# EAGLE schematic TSOC_CYBLE_R0_1 (EAGLE 6.6.0)
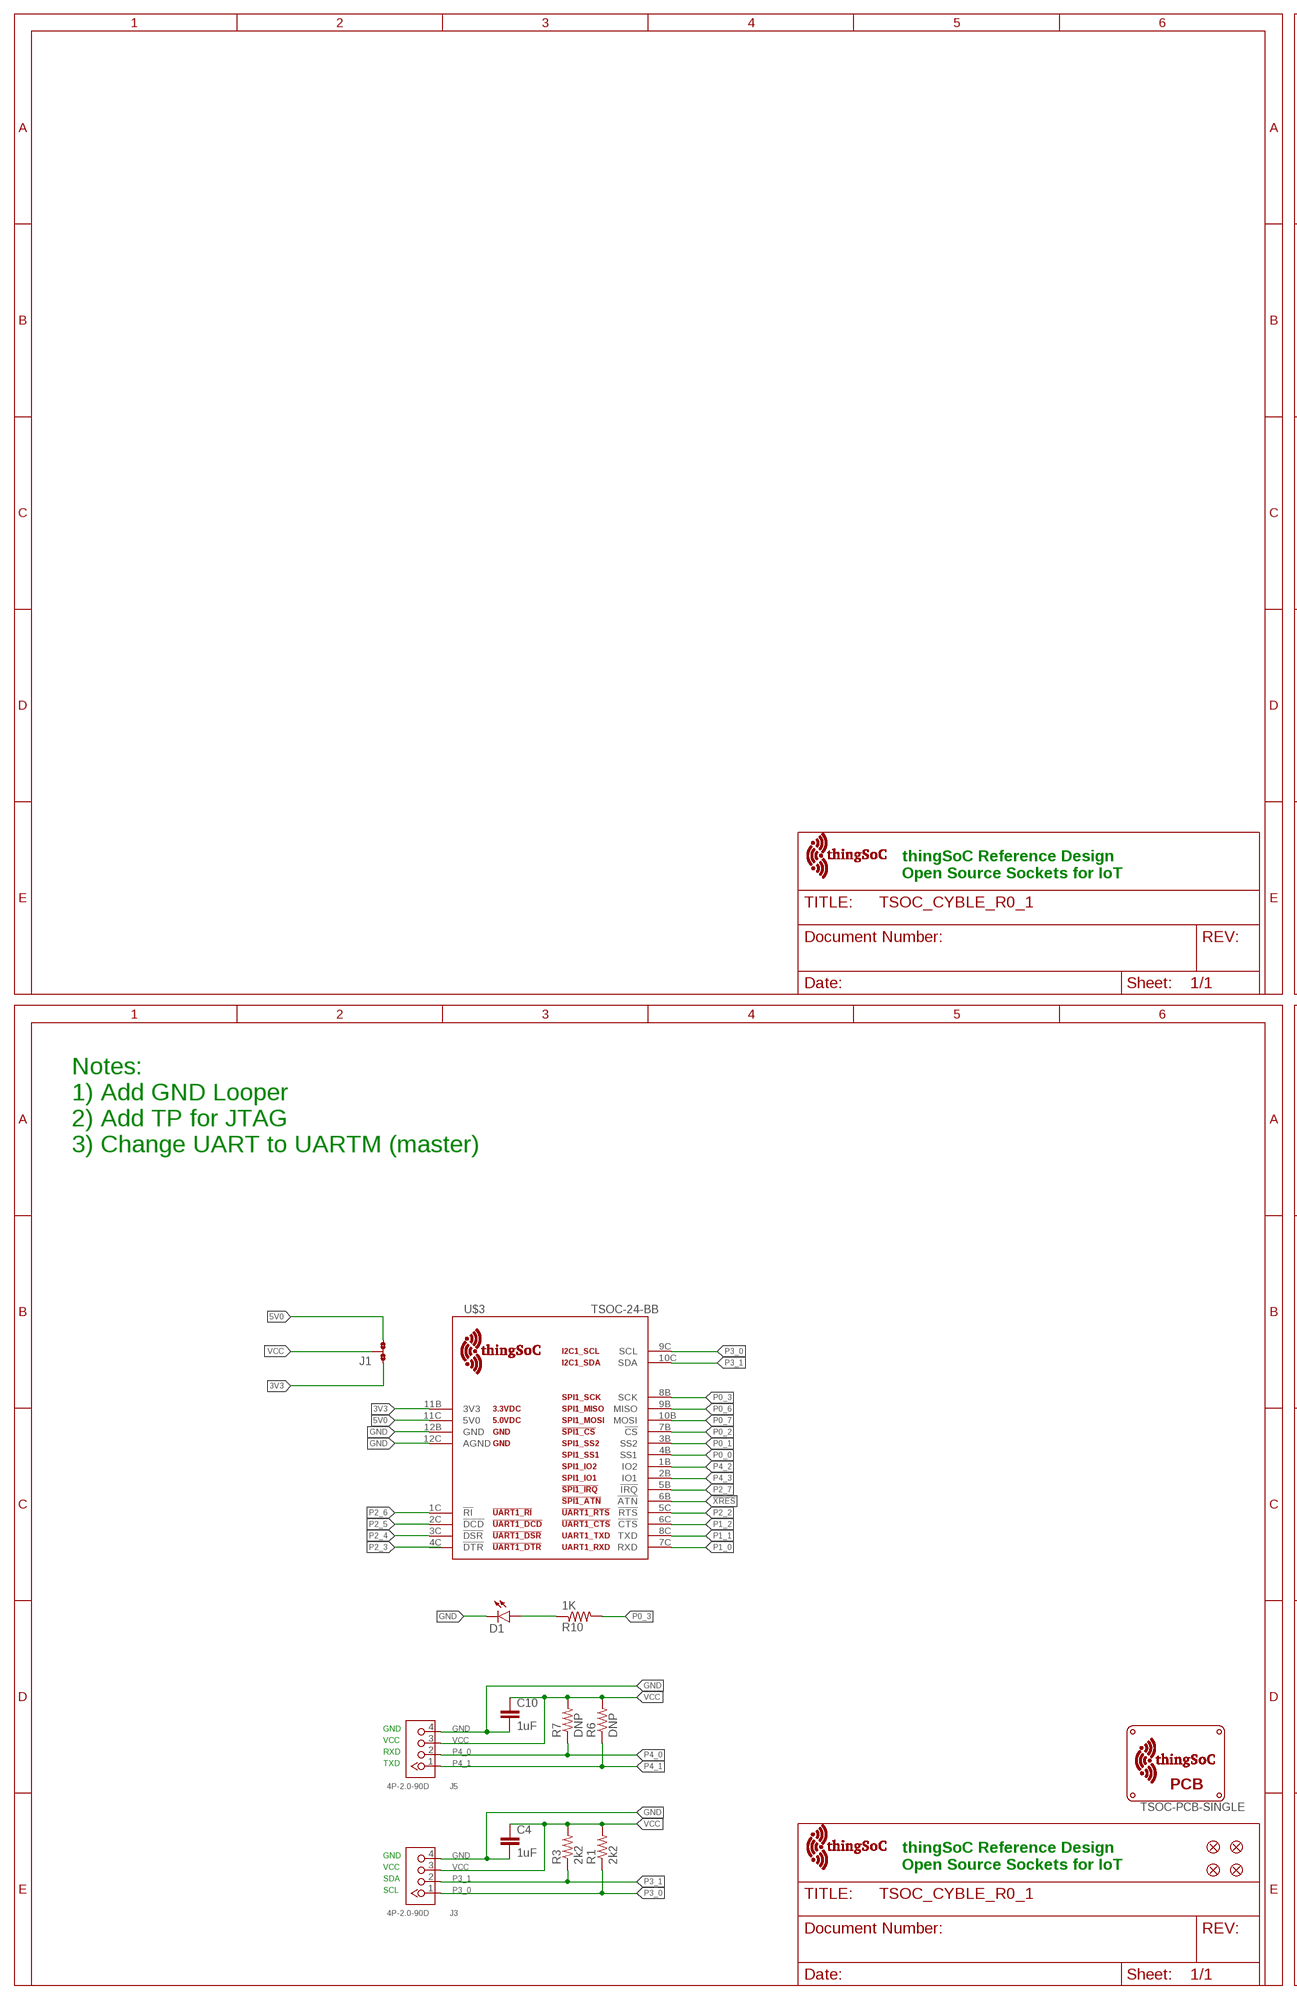
[diagram p0: schematic, sheet 1, part 1 of 2]
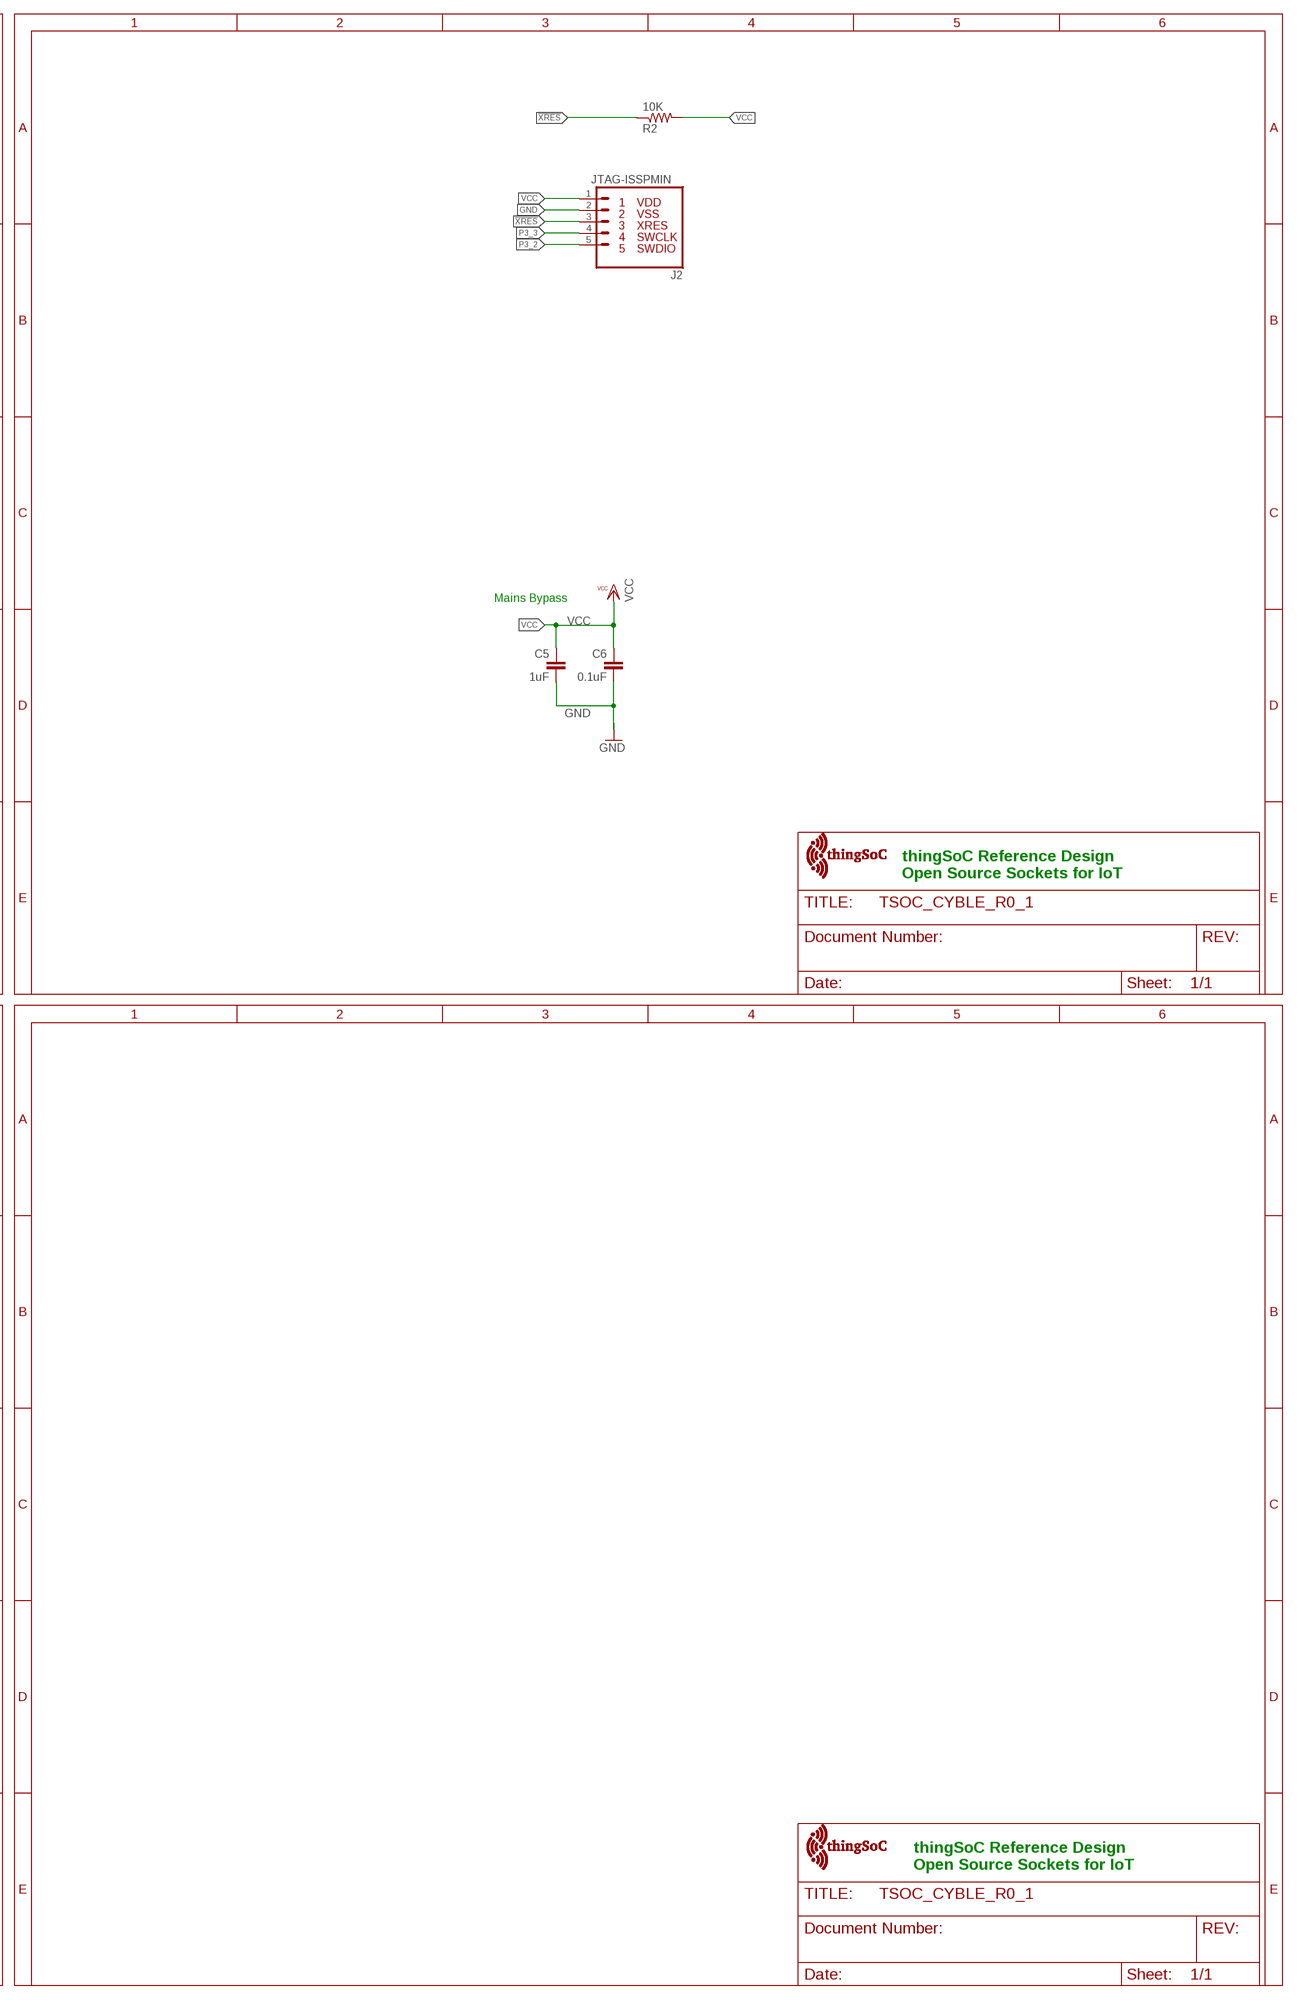
[diagram p1: schematic, sheet 1, part 2 of 2]

## Parts
C4  1uF  CAP0603-CAP  [0603-CAP]
C5  1uF  CAP0603-CAP  [0603-CAP]
C6  0.1uF  CAP0603-CAP  [0603-CAP]
C10  1uF  CAP0603-CAP  [0603-CAP]
D1  LED0603  [LED-0603]
FID1  FIDUCIALUFIDUCIAL  [MICRO-FIDUCIAL]
FID2  FIDUCIALUFIDUCIAL  [MICRO-FIDUCIAL]
FID3  FIDUCIALUFIDUCIAL  [MICRO-FIDUCIAL]
FID4  FIDUCIALUFIDUCIAL  [MICRO-FIDUCIAL]
J1  JMP-3-NO-PTH  [JMP-3-NO-PTH-2.54]
J2  JTAG-ISSPMIN  [PSOC_JTAG_MINSILK]
J3  4P-2.0-90D  GROVE-CONNECTOR-DIP-90D(4P-2.0)  [HW4-2.0-90D]
J5  4P-2.0-90D  GROVE-CONNECTOR-DIP-90D(4P-2.0)  [HW4-2.0-90D]
R1  2k2  RESISTOR0603-RES  [0603-RES]
R2  10K  RESISTOR_SFE0603-RES  [0603-RES]
R3  2k2  RESISTOR0603-RES  [0603-RES]
R6  DNP  RESISTOR0603-RES  [0603-RES]
R7  DNP  RESISTOR0603-RES  [0603-RES]
R10  1K  RESISTOR_SFE0603-RES  [0603-RES]
U$1  TSOC-LOGO-MED  [TSOC-LOGO-MED]
U$2  TSOC-PCB-SINGLE  [TSOC-BB-BRD-DIM]
U$3  TSOC-24-BB  [TSOC-BB-S24]
U$4  TSOC-LOGO-MED  [TSOC-LOGO-MED]
U$100  TSOC-LOGO-SMALL  [TSOC-LOGO-SML]
U$101  TSOC-LOGO-LRG  [TSOC-LOGO-LRG]

## Nets
3V3: J1.1 U$3.11B(3V3)
5V0: J1.3 U$3.11C(5V0)
!XRES: J2.3 R2.1 U$3.6B(!ATN)
GND: C4.2 C5.2 C6.2 C10.2 D1.C J2.2 J3.4 J5.4 U$3.12B(GND) U$3.12C(AGND)
N$17: D1.A R10.1
P0_0: U$3.4B(SS1)
P0_1: U$3.3B(SS2)
P0_2: U$3.7B(!CS)
P0_3: R10.2 U$3.8B(SCK)
P0_6: U$3.9B(MISO)
P0_7: U$3.10B(MOSI)
P1_0: U$3.7C(RXD)
P1_1: U$3.8C(TXD)
P1_2: U$3.6C(!CTS)
P2_2: U$3.5C(!RTS)
P2_3: U$3.4C(!DTR)
P2_4: U$3.3C(!DSR)
P2_5: U$3.2C(!DCD)
P2_6: U$3.1C(!RI)
P2_7: U$3.5B(!IRQ)
P3_0: J3.1 R1.1 U$3.9C(SCL)
P3_1: J3.2 R3.1 U$3.10C(SDA)
P3_2: J2.5
P3_3: J2.4
P4_0: J5.2 R7.1
P4_1: J5.1 R6.1
P4_2: U$3.1B(IO2)
P4_3: U$3.2B(IO1)
VCC: C4.1 C5.1 C6.1 C10.1 J1.2 J2.1 J3.3 J5.3 R1.2 R2.2 R3.2 R6.2 R7.2

## Notes on the sheet
- Mains Bypass
- thingSoC Reference Design
  Open Source Sockets for IoT
- thingSoC Reference Design
  Open Source Sockets for IoT
- Notes:
  1) Add GND Looper
  2) Add TP for JTAG
  3) Change UART to UARTM (master)
- GND
- VCC
- RXD
- TXD
- GND
- VCC
- thingSoC Reference Design
  Open Source Sockets for IoT
- thingSoC Reference Design
  Open Source Sockets for IoT
- SDA
- SCL

## Library data of the parts
C4 C10 = SparkFun-Passives:CAP: Capacitor Standard 0603 ceramic capacitor, and 0.1" leaded capacitor.
C5 C6 = PatternAgents-Misc:CAP: Capacitor Standard 0603 ceramic capacitor, and 0.1" leaded capacitor.
D1 = TSOC-ESP8266-BASE:LED: LEDs Standard schematic elements and footprints for 5mm, 3mm, 1206, and 0603 sized LEDs. 5mm - Spark Fun Electronics SKU : COM-00529 (and others)
FID1-FID4 = TSOC-ESP8266-BASE:FIDUCIAL: Fiducial Alignment Points Various fiducial points for machine vision alignment.
J1 = PatternAgents-ProtoPads:JMP-3-NO: Three Terminal Jumper - Normally Open All Pads Open (unconnected) PatternAgents ProtoPads Library Schematic and PCB layout libraries for design patterns by PatternAgents. For the CADSoft Eagle CAD program : http://www.cadsoftusa.com/download-eagle/ Source LBR : http://www.patternagents.com Github : https://github.com/PatternAgents License : http://creativecommons.org/licenses/by-sa/4.0/ (Creative Commons 4.0) THIS SOFTWARE IS PROVIDED BY THE CONTRIBUTORS "AS IS" AND WITHOUT ANY EXPRESS OR IMPLIED WARRANTIES, INCLUDING, BUT NOT LIMITED TO, THE IMPLIED WARRANTIES OF MERCHANTABILITY AND FITNESS FOR A PARTICULAR PURPOSE ARE DISCLAIMED. IN NO EVENT SHALL THE COPYRIGHT OWNER OR CONTRIBUTORS BE LIABLE FOR ANY DIRECT, INDIRECT, INCIDENTAL, SPECIAL, EXEMPLARY, OR CONSEQUENTIAL DAMAGES (INCLUDING, BUT NOT LIMITED TO, PROCUREMENT OF SUBSTITUTE GOODS OR SERVICES; LOSS OF USE, DATA, OR PROFITS; OR BUSINESS INTERRUPTION) HOWEVER CAUSED AND ON ANY THEORY OF LIABILITY, WHETHER IN CONTRACT, STRICT LIABILITY, OR TORT (INCLUDING NEGLIGENCE OR OTHERWISE) ARISING IN ANY WAY OUT OF THE USE OF THIS SOFTWARE, EVEN IF ADVISED OF THE POSSIBILITY OF SUCH DAMAGE.
J2 = PatternAgents-Cypress:JTAG-ISSP: JTAG-ISSP Programming Connector (5 Pin ISSP JTAG Connector) LBR Source: http://www.patternagents.com THIS SOFTWARE IS PROVIDED BY THE CONTRIBUTORS "AS IS" AND WITHOUT ANY EXPRESS OR IMPLIED WARRANTIES, INCLUDING, BUT NOT LIMITED TO, THE IMPLIED WARRANTIES OF MERCHANTABILITY AND FITNESS FOR A PARTICULAR PURPOSE ARE DISCLAIMED. IN NO EVENT SHALL THE COPYRIGHT OWNER OR CONTRIBUTORS BE LIABLE FOR ANY DIRECT, INDIRECT, INCIDENTAL, SPECIAL, EXEMPLARY, OR CONSEQUENTIAL DAMAGES (INCLUDING, BUT NOT LIMITED TO, PROCUREMENT OF SUBSTITUTE GOODS OR SERVICES; LOSS OF USE, DATA, OR PROFITS; OR BUSINESS INTERRUPTION) HOWEVER CAUSED AND ON ANY THEORY OF LIABILITY, WHETHER IN CONTRACT, STRICT LIABILITY, OR TORT (INCLUDING NEGLIGENCE OR OTHERWISE) ARISING IN ANY WAY OUT OF THE USE OF THIS SOFTWARE, EVEN IF ADVISED OF THE POSSIBILITY OF SUCH DAMAGE.
J3 J5 = Seeed-Connector -2016:GROVE-CONNECTOR-DIP-90D(4P-2.0): 320110034
R1 R3 R6 R7 = SparkFun-Passives:RESISTOR: Resistor Basic schematic elements and footprints for 0603, 1206, and PTH resistors.
R2 R10 = PatternAgents-Misc:RESISTOR_SFE: Resistor Basic schematic elements and footprints for 0603, 1206, and PTH resistors.
U$1 U$4 U$100 U$101 = thingSoC:TSOC-LOGO: thingSoC Logo Source LBR : http://www.thingsoc.com Github : https://github.com/thingsoc License : http://creativecommons.org/licenses/by-sa/4.0/ (Creative Commons 4.0) THIS SOFTWARE IS PROVIDED BY THE CONTRIBUTORS "AS IS" AND WITHOUT ANY EXPRESS OR IMPLIED WARRANTIES, INCLUDING, BUT NOT LIMITED TO, THE IMPLIED WARRANTIES OF MERCHANTABILITY AND FITNESS FOR A PARTICULAR PURPOSE ARE DISCLAIMED. IN NO EVENT SHALL THE COPYRIGHT OWNER OR CONTRIBUTORS BE LIABLE FOR ANY DIRECT, INDIRECT, INCIDENTAL, SPECIAL, EXEMPLARY, OR CONSEQUENTIAL DAMAGES (INCLUDING, BUT NOT LIMITED TO, PROCUREMENT OF SUBSTITUTE GOODS OR SERVICES; LOSS OF USE, DATA, OR PROFITS; OR BUSINESS INTERRUPTION) HOWEVER CAUSED AND ON ANY THEORY OF LIABILITY, WHETHER IN CONTRACT, STRICT LIABILITY, OR TORT (INCLUDING NEGLIGENCE OR OTHERWISE) ARISING IN ANY WAY OUT OF THE USE OF THIS SOFTWARE, EVEN IF ADVISED OF THE POSSIBILITY OF SUCH DAMAGE.
U$2 = thingSoC:TSOC-PCB: thingSoC PCB Outlines Boards Outlines for Standard Sizes (in the DImension Layer) (Registration marks in the tDocu layer - make sure to turn on tDocu/bDocu) Source LBR : http://www.thingsoc.com Github : https://github.com/thingsoc License : http://creativecommons.org/licenses/by-sa/4.0/ (Creative Commons 4.0) THIS SOFTWARE IS PROVIDED BY THE CONTRIBUTORS "AS IS" AND WITHOUT ANY EXPRESS OR IMPLIED WARRANTIES, INCLUDING, BUT NOT LIMITED TO, THE IMPLIED WARRANTIES OF MERCHANTABILITY AND FITNESS FOR A PARTICULAR PURPOSE ARE DISCLAIMED. IN NO EVENT SHALL THE COPYRIGHT OWNER OR CONTRIBUTORS BE LIABLE FOR ANY DIRECT, INDIRECT, INCIDENTAL, SPECIAL, EXEMPLARY, OR CONSEQUENTIAL DAMAGES (INCLUDING, BUT NOT LIMITED TO, PROCUREMENT OF SUBSTITUTE GOODS OR SERVICES; LOSS OF USE, DATA, OR PROFITS; OR BUSINESS INTERRUPTION) HOWEVER CAUSED AND ON ANY THEORY OF LIABILITY, WHETHER IN CONTRACT, STRICT LIABILITY, OR TORT (INCLUDING NEGLIGENCE OR OTHERWISE) ARISING IN ANY WAY OUT OF THE USE OF THIS SOFTWARE, EVEN IF ADVISED OF THE POSSIBILITY OF SUCH DAMAGE.
U$3 = thingSoC:TSOC-24: thingSoC Twenty-Four(24) Pin Socket Source LBR : http://www.thingsoc.com Github : https://github.com/thingsoc License : http://creativecommons.org/licenses/by-sa/4.0/ (Creative Commons 4.0) THIS SOFTWARE IS PROVIDED BY THE CONTRIBUTORS "AS IS" AND WITHOUT ANY EXPRESS OR IMPLIED WARRANTIES, INCLUDING, BUT NOT LIMITED TO, THE IMPLIED WARRANTIES OF MERCHANTABILITY AND FITNESS FOR A PARTICULAR PURPOSE ARE DISCLAIMED. IN NO EVENT SHALL THE COPYRIGHT OWNER OR CONTRIBUTORS BE LIABLE FOR ANY DIRECT, INDIRECT, INCIDENTAL, SPECIAL, EXEMPLARY, OR CONSEQUENTIAL DAMAGES (INCLUDING, BUT NOT LIMITED TO, PROCUREMENT OF SUBSTITUTE GOODS OR SERVICES; LOSS OF USE, DATA, OR PROFITS; OR BUSINESS INTERRUPTION) HOWEVER CAUSED AND ON ANY THEORY OF LIABILITY, WHETHER IN CONTRACT, STRICT LIABILITY, OR TORT (INCLUDING NEGLIGENCE OR OTHERWISE) ARISING IN ANY WAY OUT OF THE USE OF THIS SOFTWARE, EVEN IF ADVISED OF THE POSSIBILITY OF SUCH DAMAGE.